# Altium schematic sheet HD-TFT-IT9854.SchDoc
size A3
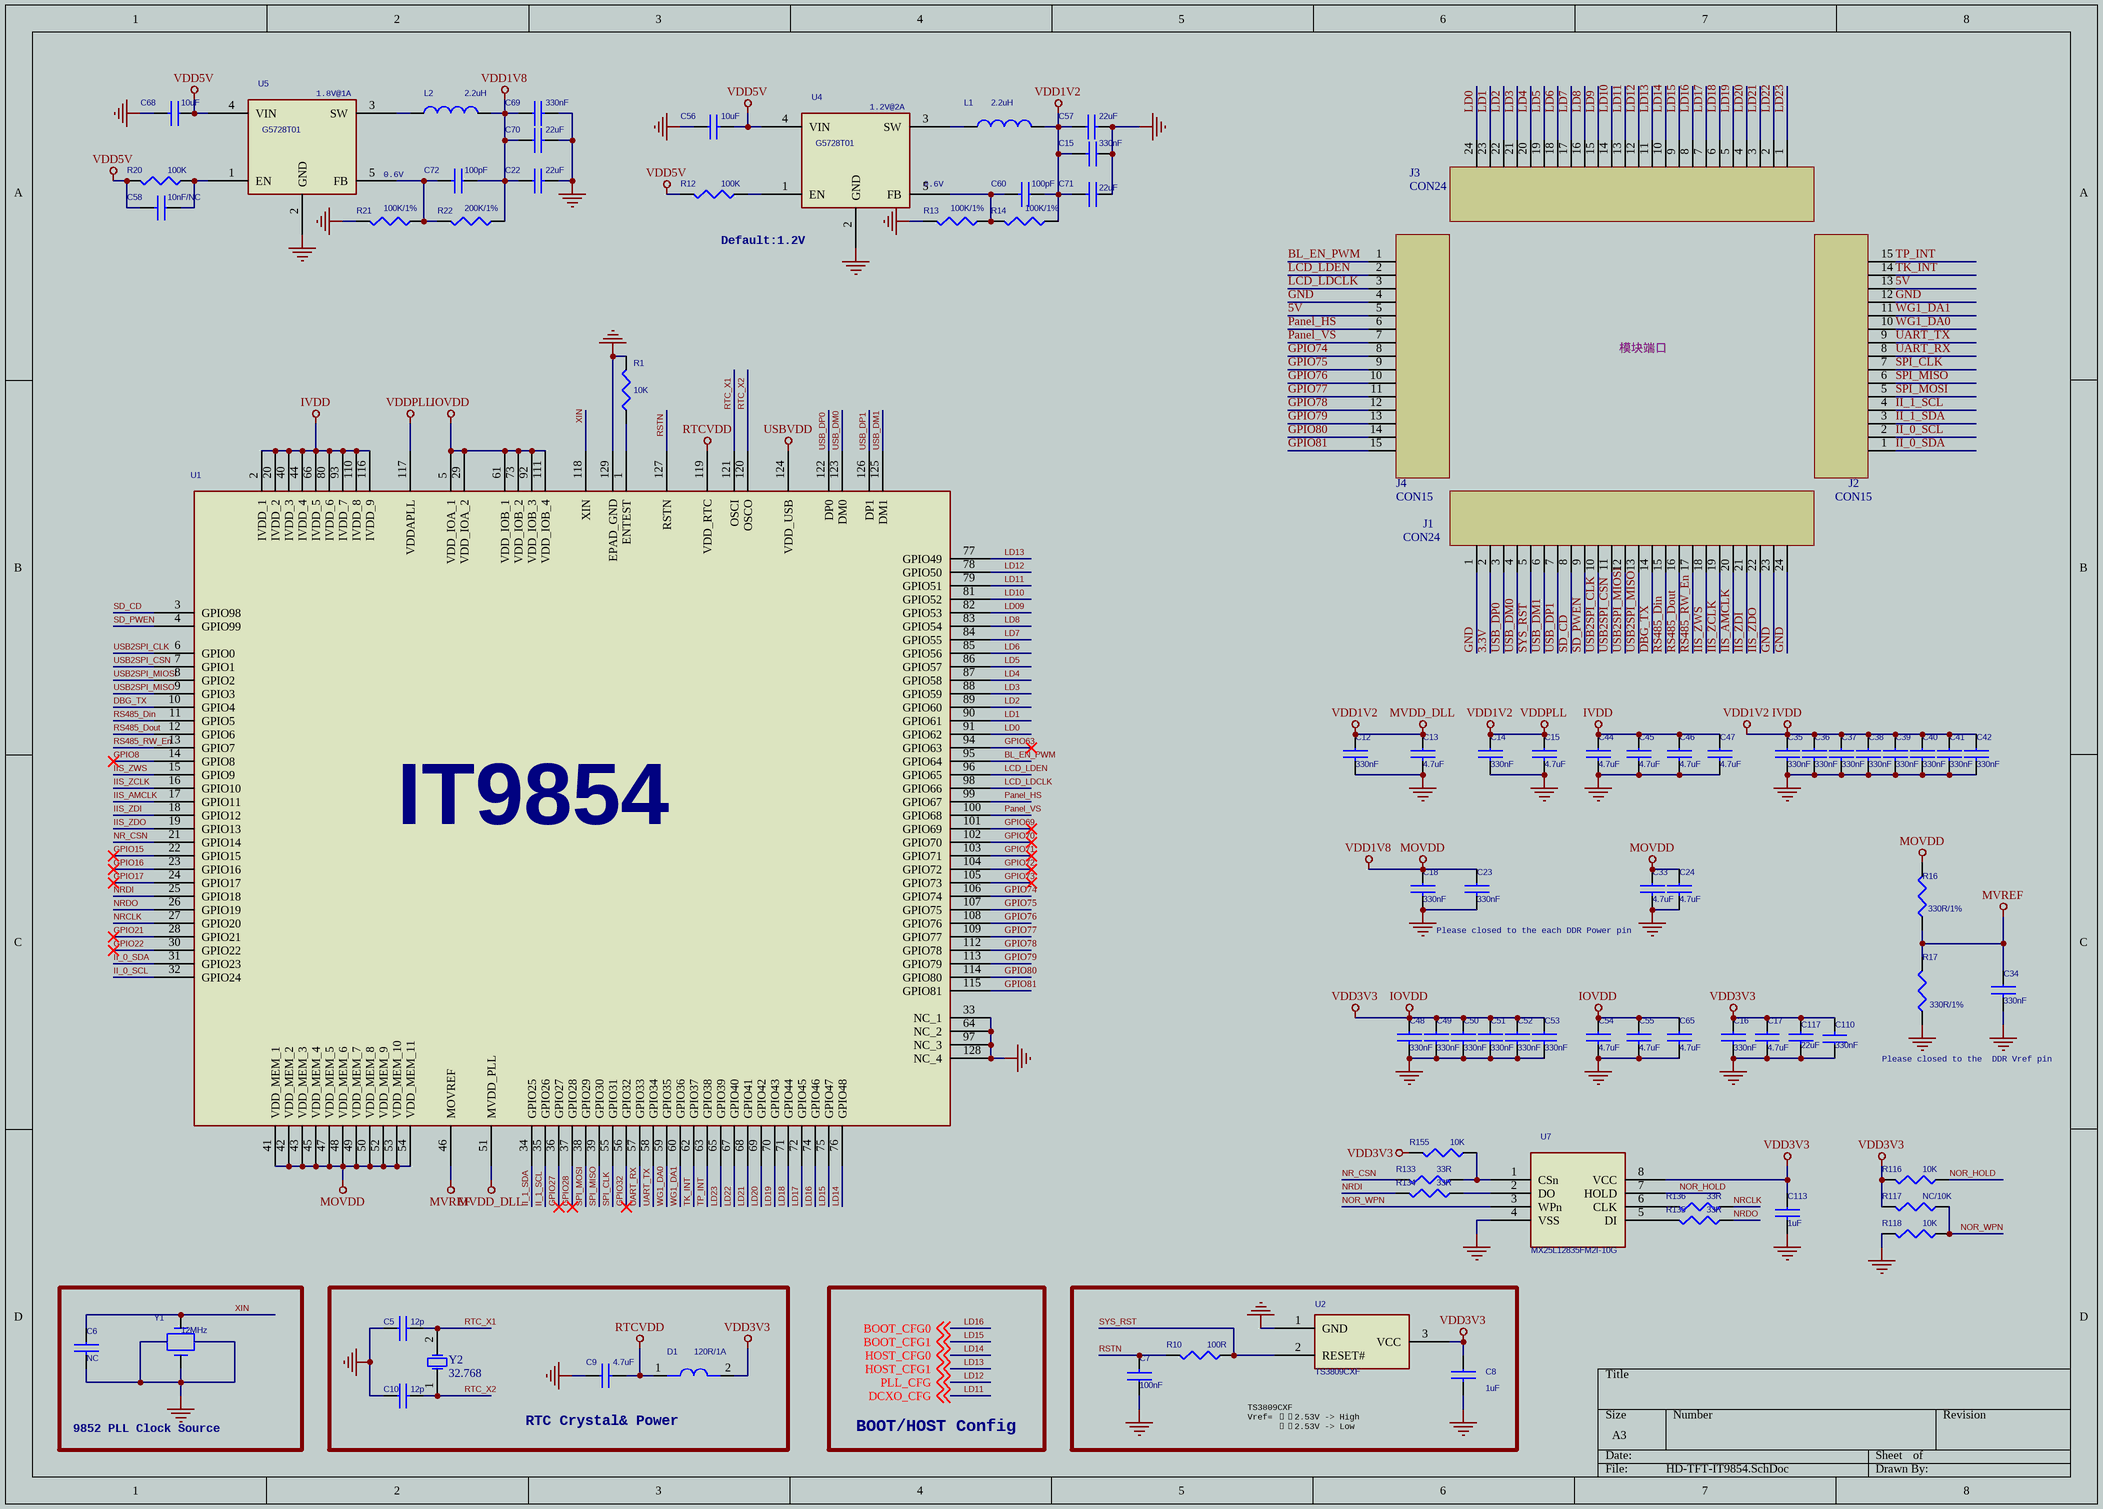
[diagram p0: HD-TFT-IT9854.SchDoc]

## Parts
(Parts that share a designator on the sheet are numbered #1, #2 ... from top to bottom, then left to right.)
C5  12p  [C0402]
C6  NC  [C0402]
C7  100nF  [C0402]
C8  1uF  [C0402]
C9  4.7uF  [C0402]
C10  12p  [C0402]
C12  330nF  [C0402]
C13  4.7uF  [C0402]
C14  330nF  [C0402]
C15#1  330nF  [C0402]
C15#2  4.7uF  [C0402]
C16  330nF  [C0402]
C17  4.7uF  [C0402]
C18  330nF  [C0402]
C22  22uF  [C0603]
C23  330nF  [C0402]
C24  4.7uF  [C0402]
C33  4.7uF  [C0402]
C34  330nF  [C0402]
C35  330nF  [C0402]
C36  330nF  [C0402]
C37  330nF  [C0402]
C38  330nF  [C0402]
C39  330nF  [C0402]
C40  330nF  [C0402]
C41  330nF  [C0402]
C42  330nF  [C0402]
C44  4.7uF  [C0402]
C45  4.7uF  [C0402]
C46  4.7uF  [C0402]
C47  4.7uF  [C0402]
C48  330nF  [C0402]
C49  330nF  [C0402]
C50  330nF  [C0402]
C51  330nF  [C0402]
C52  330nF  [C0402]
C53  330nF  [C0402]
C54  4.7uF  [C0402]
C55  4.7uF  [C0402]
C56  10uF  [C0603]
C57  22uF  [C0603]
C58  10nF/NC  [C0402]
C60  100pF  [C0402]
C65  4.7uF  [C0402]
C68  10uF  [C0603]
C69  330nF  [C0402]
C70  22uF  [C0603]
C71  22uF  [C0603]
C72  100pF  [C0402]
C110  330nF  [C0402]
C113  1uF  [C0402]
C117  22uF  [C0603]
D1  120R/1A  [L0603]
J1  CON24
J2  CON15
J3  CON24
J4  CON15
L1  2.2uH  [ZAD-4030]
L2  2.2uH  [ZAD-4030]
R1  10K  [R0402]
R10  100R  [R0402]
R12  100K  [R0402]
R13  100K/1%  [R0402]
R14  100K/1%  [R0402]
R16  330R/1%  [R0402]
R17  330R/1%  [R0402]
R20  100K  [R0402]
R21  100K/1%  [R0402]
R22  200K/1%  [R0402]
R116  10K  [R0402]
R117  NC/10K  [R0402]
R118  10K  [R0402]
R133  33R  [R0402]
R134  33R  [R0402]
R135  33R  [R0402]
R136  33R  [R0402]
R155  10K  [R0402]
U1  IT9854  [LQFP-128P-E$2F$0.4$2F$14X14]
U2  TS3809CXF  [SOT23-3P-1$2F$GSD-1]
U4  G5728T01  [TSOT25-5P$2F$0.95$2F$3X3]
U5  G5728T01  [TSOT25-5P$2F$0.95$2F$3X3]
U7  MX25L12835FM2I-10G  [SOP-8P$2F$1.27$2F$5X8]
Y1  12MHz  [CRYSTALS-SMD-320X250]
Y2  32.768  [XTAL-3215]

## Blocks framed on the sheet
9852 PLL Clock Source: C6 Y1
RTC Crystal& Power: C5 C9 C10 D1 Y2

## Nets
GND: C5.1 C6.2 C7.1 C8.2 C9.1 C10.1 C12.2 C13.2 C14.2 C15#1.1 C15#2.2 C16.2 C17.2 C18.2 C22.2 C23.2 C24.2 C33.2 C34.2 C35.2 C36.2 C37.2 C38.2 C39.2 C40.2 C41.2 C42.2 C44.2 C45.2 C46.2 C47.2 C48.2 C49.2 C50.2 C51.2 C52.2 C53.2 C54.2 C55.2 C56.1 C57.2 C65.2 C68.2 C69.2 C70.2 C71.1 C110.1 C113.2 C117.2 J1.1 J1.23 J1.24 J2.12 J4.4 R1.2 R13.2 R17.1 R21.2 R118.2 U1.33(NC_1) U1.64(NC_2) U1.97(NC_3) U1.128(NC_4) U1.129(EPAD_GND) U2.1(GND) U4.2(GND) U5.2(GND) U7.4(VSS) Y1.2 Y1.3 Y1.4
IOVDD: C8.1 C16.1 C17.1 C48.1 C49.1 C50.1 C51.1 C52.1 C53.1 C54.1 C55.1 C65.1 C110.2 C113.1 C117.1 D1.2 R116.2 R117.2 R155.2 U1.5(VDD_IOA_1) U1.29(VDD_IOA_2) U1.61(VDD_IOB_1) U1.73(VDD_IOB_2) U1.92(VDD_IOB_3) U1.111(VDD_IOB_4) U2.3(VCC) U7.8(VCC)  [also labelled VDD3V3]
IVDD: C12.1 C13.1 C14.1 C15#1.2 C15#2.1 C35.1 C36.1 C37.1 C38.1 C39.1 C40.1 C41.1 C42.1 C44.1 C45.1 C46.1 C47.1 C57.1 C60.1 C71.2 L1.2 R14.1 U1.2(IVDD_1) U1.20(IVDD_2) U1.40(IVDD_3) U1.44(IVDD_4) U1.51(MVDD_PLL) U1.66(IVDD_5) U1.80(IVDD_6) U1.93(IVDD_7) U1.110(IVDD_8) U1.116(IVDD_9) U1.117(VDDAPLL)  [also labelled MVDD_DLL, VDD1V2, VDDPLL]
MOVDD: C18.1 C22.1 C23.1 C24.1 C33.1 C69.1 C70.1 C72.1 L2.2 R16.2 R22.1 U1.41(VDD_MEM_1) U1.42(VDD_MEM_2) U1.43(VDD_MEM_3) U1.45(VDD_MEM_4) U1.47(VDD_MEM_5) U1.48(VDD_MEM_6) U1.49(VDD_MEM_7) U1.50(VDD_MEM_8) U1.52(VDD_MEM_9) U1.53(VDD_MEM_10) U1.54(VDD_MEM_11)  [also labelled VDD1V8]
MVREF: C34.1 R16.1 R17.2 U1.46(MOVREF)
RTCVDD: C9.2 D1.1 U1.119(VDD_RTC)
USBVDD: U1.124(VDD_USB)
VDD5V: C56.2 C58.2 C68.1 R12.2 R20.2 U4.4(VIN) U5.4(VIN)
3.3V: J1.2
5V: J2.13 J4.5
BL_EN_PWM: J4.1 U1.95(GPIO64)
DBG_TX: J1.14 U1.10(GPIO4)
GPIO8: U1.14(GPIO8)
GPIO15: U1.22(GPIO15)
GPIO16: U1.23(GPIO16)
GPIO17: U1.24(GPIO17)
GPIO21: U1.28(GPIO21)
GPIO22: U1.30(GPIO22)
GPIO27: U1.36(GPIO27)
GPIO28: U1.37(GPIO28)
GPIO32: U1.56(GPIO32)
GPIO63: U1.94(GPIO63)
GPIO69: U1.101(GPIO69)
GPIO70: U1.102(GPIO70)
GPIO71: U1.103(GPIO71)
GPIO72: U1.104(GPIO72)
GPIO73: U1.105(GPIO73)
GPIO74: J4.8 U1.106(GPIO74)
GPIO75: J4.9 U1.107(GPIO75)
GPIO76: J4.10 U1.108(GPIO76)
GPIO77: J4.11 U1.109(GPIO77)
GPIO78: J4.12 U1.112(GPIO78)
GPIO79: J4.13 U1.113(GPIO79)
GPIO80: J4.14 U1.114(GPIO80)
GPIO81: J4.15 U1.115(GPIO81)
II_0_SCL: J2.2 U1.32(GPIO24)
II_0_SDA: J2.1 U1.31(GPIO23)
II_1_SCL: J2.4 U1.35(GPIO26)
II_1_SDA: J2.3 U1.34(GPIO25)
IIS_AMCLK: J1.20 U1.17(GPIO11)
IIS_ZCLK: J1.19 U1.16(GPIO10)
IIS_ZDI: J1.21 U1.18(GPIO12)
IIS_ZDO: J1.22 U1.19(GPIO13)
IIS_ZWS: J1.18 U1.15(GPIO9)
LCD_LDCLK: J4.3 U1.98(GPIO66)
LCD_LDEN: J4.2 U1.96(GPIO65)
LD0: J3.24 U1.91(GPIO62)
LD1: J3.23 U1.90(GPIO61)
LD2: J3.22 U1.89(GPIO60)
LD3: J3.21 U1.88(GPIO59)
LD4: J3.20 U1.87(GPIO58)
LD5: J3.19 U1.86(GPIO57)
LD6: J3.18 U1.85(GPIO56)
LD7: J3.17 U1.84(GPIO55)
LD8: J3.16 U1.83(GPIO54)
LD09: U1.82(GPIO53)
LD9: J3.15
LD10: J3.14 U1.81(GPIO52)
LD11: J3.13 U1.79(GPIO51) ; off-sheet DCXO_CFG  [also labelled DCXO_CFG]
LD12: J3.12 U1.78(GPIO50) ; off-sheet PLL_CFG  [also labelled PLL_CFG]
LD13: J3.11 U1.77(GPIO49) ; off-sheet HOST_CFG1  [also labelled HOST_CFG1]
LD14: J3.10 U1.76(GPIO48) ; off-sheet HOST_CFG0  [also labelled HOST_CFG0]
LD15: J3.9 U1.75(GPIO47) ; off-sheet BOOT_CFG1  [also labelled BOOT_CFG1]
LD16: J3.8 U1.74(GPIO46) ; off-sheet BOOT_CFG0  [also labelled BOOT_CFG0]
LD17: J3.7 U1.72(GPIO45)
LD18: J3.6 U1.71(GPIO44)
LD19: J3.5 U1.70(GPIO43)
LD20: J3.4 U1.69(GPIO42)
LD21: J3.3 U1.68(GPIO41)
LD22: J3.2 U1.67(GPIO40)
LD23: J3.1 U1.65(GPIO39)
NOR_HOLD: R116.1 U7.7(HOLD)
NOR_WPN: R117.1 R118.1 U7.3(WPn)
NR_CSN: R133.2 U1.21(GPIO14)
NRCLK: R136.1 U1.27(GPIO20)
NRDI: R134.2 U1.25(GPIO18)
NRDO: R135.1 U1.26(GPIO19)
Panel_HS: J4.6 U1.99(GPIO67)
Panel_VS: J4.7 U1.100(GPIO68)
RS485_Din: J1.15 U1.11(GPIO5)
RS485_Dout: J1.16 U1.12(GPIO6)
RS485_RW_En: J1.17 U1.13(GPIO7)
RSTN: C7.2 R10.2 U1.127(RSTN)
RTC_X1: C5.2 U1.121(OSCI) Y2.2(OSC2)
RTC_X2: C10.2 U1.120(OSCO) Y2.1(OSC1)
SD_CD: J1.8 U1.3(GPIO98)
SD_PWEN: J1.9 U1.4(GPIO99)
SPI_CLK: J2.7 U1.55(GPIO31)
SPI_MISO: J2.6 U1.39(GPIO30)
SPI_MOSI: J2.5 U1.38(GPIO29)
SYS_RST: J1.5 R10.1 U2.2(RESET#)
TK_INT: J2.14 U1.62(GPIO37)
TP_INT: J2.15 U1.63(GPIO38)
UART_RX: J2.8 U1.57(GPIO33)
UART_TX: J2.9 U1.58(GPIO34)
USB2SPI_CLK: J1.10 U1.6(GPIO0)
USB2SPI_CSN: J1.11 U1.7(GPIO1)
USB2SPI_MIOSI: J1.12 U1.8(GPIO2)
USB2SPI_MISO: J1.13 U1.9(GPIO3)
USB_DM0: J1.4 U1.123(DM0)
USB_DM1: J1.6 U1.125(DM1)
USB_DP0: J1.3 U1.122(DP0)
USB_DP1: J1.7 U1.126(DP1)
WG1_DA0: J2.10 U1.59(GPIO35)
WG1_DA1: J2.11 U1.60(GPIO36)
XIN: C6.1 U1.118(XIN) Y1.1
NetC58_1: C58.1 R20.1 U5.1(EN)
NetC60_2: C60.2 R13.1 R14.2 U4.5(FB)
NetC72_2: C72.2 R21.1 R22.2 U5.5(FB)
NetL1_1: L1.1 U4.3(SW)
NetL2_1: L2.1 U5.3(SW)
NetR1_1: R1.1 U1.1(ENTEST)
NetR12_1: R12.1 U4.1(EN)
NetR133_1: R133.1 R155.1 U7.1(CSn)
NetR134_1: R134.1 U7.2(DO)
NetR135_2: R135.2 U7.5(DI)
NetR136_2: R136.2 U7.6(CLK)

## Notes on the sheet
- (near U5) 1.8V@1A
- (near U4) 1.2V@2A
- 0.6V
- Default:1.2V
- (near U4) 0.6V
- 模块端口
- Please closed to the each DDR Power pin
- Please closed to the  DDR Vref pin
- BOOT/HOST Config
- TS3809CXF
  Vref= 2.53V -> High
  2.53V -> Low

## Library data of the parts
C5-C10 C12-C14 C15#2 C16-C18 C23 C24 C33-C42 C44-C55 C65 C113 = CAP NP_Dup2
C15#1 C69 C110 = CAP NP_0: Voltage: X5R/10V
C22 C57 C70 C71 C117 = CAP NP: Voltage: X5R/6.3V
C56 C68 = CAP NP: Voltage: X5R/10V
C58 C60 C72 = CAP NP: Voltage: COG/5V
D1 = FB 30Ohm 25% 3A 0.03R 0603: SMD Multilayer Ferrite Chip Bead,3A,30Ohm,0.03R; Manufacturer: SUNLORD; Manufacture2 P/N: PBY160808T-400Y-N; Manufacture P/N: PZ1608D300-3R0TF; Part Number: EL4.300Y060300A; PN Type: SMD FERRITE BEAD; Manufacturer2: CHILISIN
L1 L2 = INDUCTOR_0
R1 R10 R12-R14 R16 R17 R20-R22 R116-R118 R133-R136 R155 = R_Dup4
U1 = IT9852
U2 = TS809CXC_1
U4 U5 = 05. IT7831TS_TSOT25
U7 = NorFLah_EN25B16
Y1 = CRYSTAL13_0
Y2 = XTAL: Crystal Oscillator; Published: 8-Jun-2000; LatestRevisionDate: 17-Jul-2002; LatestRevisionNote: Re-released for DXP Platform.; PackageReference: R38; Publisher: Altium Limited; PackageDescription: Crystal, Thru-Hole; 2 Leads; Body 3.1 x 8.2 mm (Dia.xH)